# Altium schematic sheet connector_fridge.SchDoc
size A
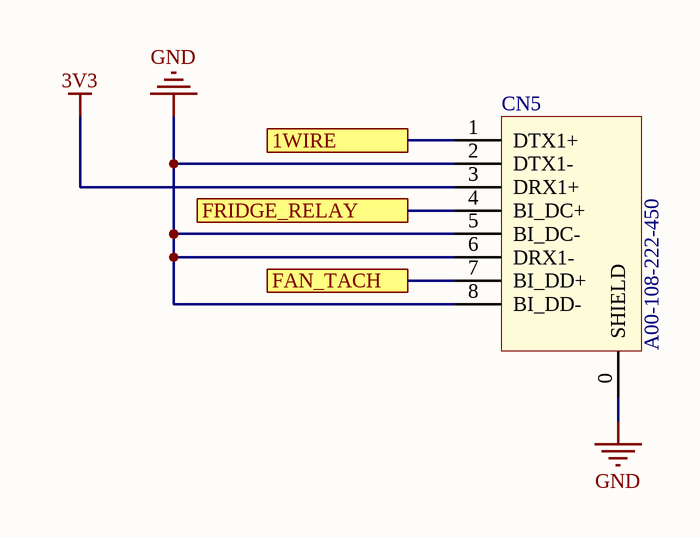
[diagram p0: connector_fridge.SchDoc]

## Parts
CN5  MFG P/N: A00-108-222-450  [RJ45 TOP ENTRY EDAC A00-108-222-450]  (hidden comment: CONN_RJ45_TOP_A00-108-222-450)

## Ports
1WIRE, FAN_TACH, FRIDGE_RELAY

## Nets
3V3: CN5.3(DRX1+)
GND: CN5.0(SHIELD) CN5.2(DTX1-) CN5.5(BI_DC-) CN5.6(DRX1-) CN5.8(BI_DD-)
1WIRE: CN5.1(DTX1+) ; port 1WIRE
FAN_TACH: CN5.7(BI_DD+) ; port FAN_TACH
FRIDGE_RELAY: CN5.4(BI_DC+) ; port FRIDGE_RELAY

## Library data of the parts
CN5 = 492: CONN, RJ-45, 1-PORT, 8-POS, VERT, 0.76um GOLD, TH; ID: 492; MFG: EDAC Inc; COMMON: 210-00203-00; XPN: XS-10003929; Status: In Development; RoHS Compliant: Yes; LOON: 210-00203-00; Gecko: 210-00203-00